# EAGLE design servo_tester (EAGLE 8.6.3)
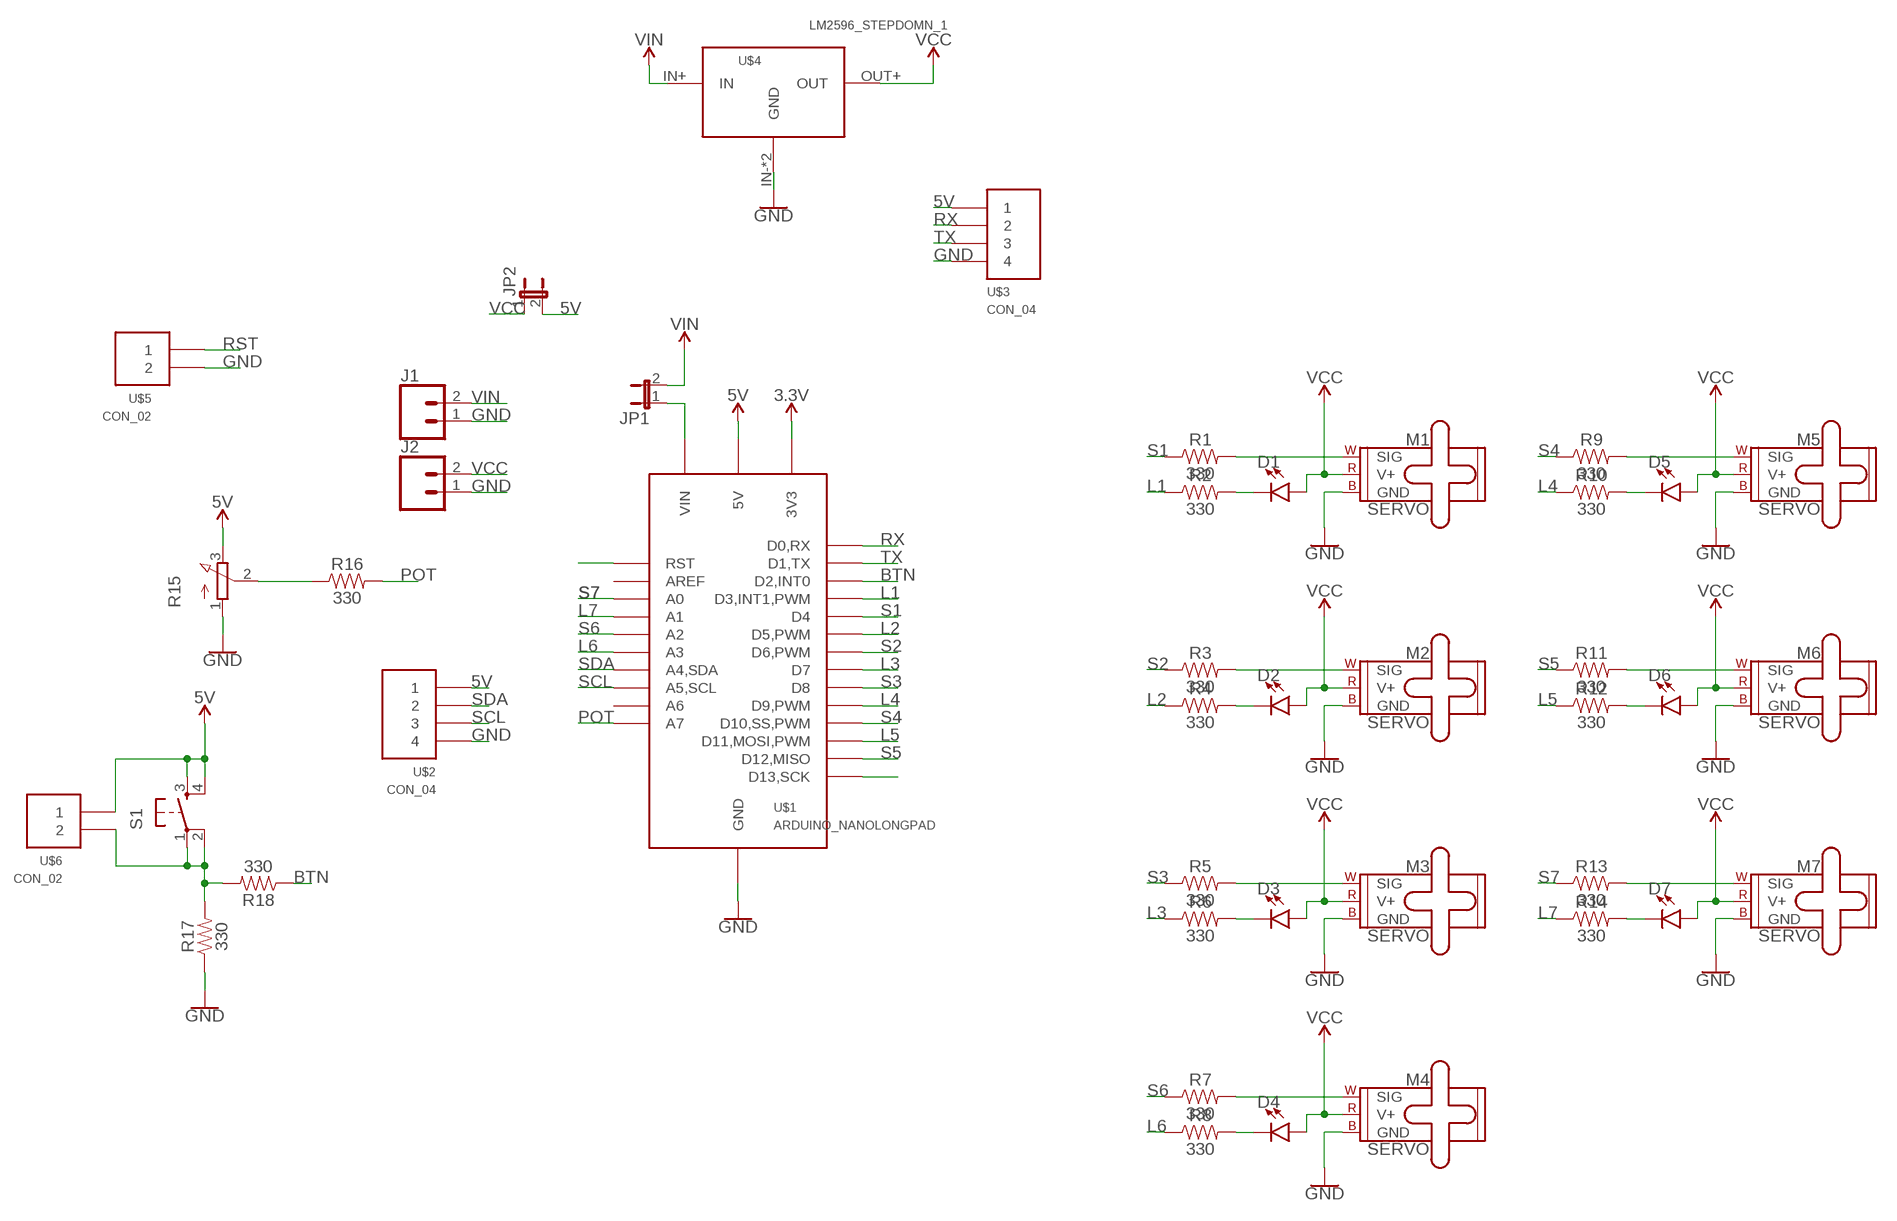
[diagram p0: schematic, sheet 1]

## Parts
D1  LED3MM  [LED_3MM]
D2  LED3MM  [LED_3MM]
D3  LED3MM  [LED_3MM]
D4  LED3MM  [LED_3MM]
D5  LED3MM  [LED_3MM]
D6  LED3MM  [LED_3MM]
D7  LED3MM  [LED_3MM]
J1  CONN_025MM  [SCREWTERMINAL-5MM-2]
J2  CONN_025MM  [SCREWTERMINAL-5MM-2]
JP1  JUMPER-2PTH  [1X02]
JP2  JUMPER-2PTH  [1X02]
M1  SERVO  [1X03]
M2  SERVO  [1X03]
M3  SERVO  [1X03]
M4  SERVO  [1X03]
M5  SERVO  [1X03]
M6  SERVO  [1X03]
M7  SERVO  [1X03]
R1  330  330OHM-0603-1/10W-1%  [0603]
R2  330  330OHM-0603-1/10W-1%  [0603]
R3  330  330OHM-0603-1/10W-1%  [0603]
R4  330  330OHM-0603-1/10W-1%  [0603]
R5  330  330OHM-0603-1/10W-1%  [0603]
R6  330  330OHM-0603-1/10W-1%  [0603]
R7  330  330OHM-0603-1/10W-1%  [0603]
R8  330  330OHM-0603-1/10W-1%  [0603]
R9  330  330OHM-0603-1/10W-1%  [0603]
R10  330  330OHM-0603-1/10W-1%  [0603]
R11  330  330OHM-0603-1/10W-1%  [0603]
R12  330  330OHM-0603-1/10W-1%  [0603]
R13  330  330OHM-0603-1/10W-1%  [0603]
R14  330  330OHM-0603-1/10W-1%  [0603]
R15  3RP/1610N  [3RP/1610N]
R16  330  330OHM-0603-1/10W-1%  [0603]
R17  330  330OHM-0603-1/10W-1%  [0603]
R18  330  330OHM-0603-1/10W-1%  [0603]
S1  TAC_SWITCHPTH  [TACTILE-PTH]
U$1  ARDUINO_NANOLONGPAD  [ARDUINO_MANO_LONGPAD]
U$2  CON_04  [4-PIN]
U$3  CON_04  [4-PIN]
U$4  LM2596_STEPDOMN_1  [STEPDOWN_1]
U$5  CON_02  [2-PIN]
U$6  CON_02  [2-PIN]

## Nets
3.3V: U$1.3V3
5V: JP2.2 R15.3(E) S1.3 S1.4 U$1.5V U$2.1 U$3.1 U$6.1
BTN: R18.1 U$1.D2(D2,INT0)
GND: J1.1 J2.1 M1.3(GND) M2.3(GND) M3.3(GND) M4.3(GND) M5.3(GND) M6.3(GND) M7.3(GND) R15.1(A) R17.1 U$1.GND@1(GND) U$1.GND@2(GND) U$2.4 U$3.4 U$4.IN-(GND) U$4.OUT-(GND) U$5.2
L1: R2.1 U$1.D3(D3,INT1,PWM)
L2: R4.1 U$1.D5(D5,PWM)
L3: R6.1 U$1.D7
L4: R10.1 U$1.D9(D9,PWM)
L5: R12.1 U$1.D11(D11,MOSI,PWM)
L6: R8.1 U$1.A3
L7: R14.1 U$1.A1
N$1: JP1.1 U$1.VIN
N$2: R15.2(S) R16.1
N$3: M1.1(SIG) R1.2
N$4: D1.K(C) R2.2
N$6: M2.1(SIG) R3.2
N$7: D2.K(C) R4.2
N$8: R17.2 R18.2 S1.1 S1.2 U$6.2
N$10: M3.1(SIG) R5.2
N$11: D3.K(C) R6.2
N$12: U$1.D13(D13,SCK)
N$15: M4.1(SIG) R7.2
N$16: D4.K(C) R8.2
N$19: M5.1(SIG) R9.2
N$20: D5.K(C) R10.2
N$23: M6.1(SIG) R11.2
N$24: D6.K(C) R12.2
N$27: M7.1(SIG) R13.2
N$28: D7.K(C) R14.2
POT: R16.2 U$1.A7
RST: U$1.RST@1(RST) U$1.RST@2(RST) U$5.1
RX: U$1.RX0(D0,RX) U$3.2
S1: R1.1 U$1.D4
S2: R3.1 U$1.D6(D6,PWM)
S3: R5.1 U$1.D8
S4: R9.1 U$1.D10(D10,SS,PWM)
S5: R11.1 U$1.D12(D12,MISO)
S6: R7.1 U$1.A2
S7: R13.1 U$1.A0
SCL: U$1.A5(A5,SCL) U$2.3
SDA: U$1.A4(A4,SDA) U$2.2
TX: U$1.TX1(D1,TX) U$3.3
VCC: D1.A D2.A D3.A D4.A D5.A D6.A D7.A J2.2 JP2.1 M1.2(V+) M2.2(V+) M3.2(V+) M4.2(V+) M5.2(V+) M6.2(V+) M7.2(V+) U$4.OUT+(OUT)
VIN: J1.2 JP1.2 U$4.IN+(IN)
Unconnected: U$1.A6 U$1.AREF

## Library data of the parts
D1-D7 = SparkFun-LED:LED: LED (Generic) Standard schematic elements and footprints for 5mm, 3mm, 1206, and 0603 sized LEDs. Generic LEDs with no color specified.; PROD_ID: DIO-08794
J1 J2 = SparkFun-Connectors:CONN_02: Multi connection point. Often used as Generic Header-pin footprint for 0.1 inch spaced/style header connections On any of the 0.1 inch spaced packages, you can populate with these: Break Away Headers - Straight <https://www.sparkfun.com/products/116> (PRT-00116) Break Away Male Headers - Right Angle <https://www.sparkfun.com/products/553> (PRT-00553) Female Headers <https://www.sparkfun.com/products/115> (PRT-00115) Break Away Headers - Machine Pin <https://www.sparkfun.com/products/117> (PRT-00117) Break Away Female Headers - Swiss Machine Pin <https://www.sparkfun.com/products/743> (PRT-00743) For SCREWTERMINALS and SPRING TERMINALS visit here: Screw Terimnals on SparkFun.com <https://www.sparkfun.com/search/results?term=Screw+Terminals> (5mm/3.5mm/2.54mm spacing) This device is also useful as a general connection point to wire up your design to another part of your project. Our various solder wires solder well into these plated through hole pads. Hook-Up Wire - Assortment (Stranded, 22 AWG) <https://www.sparkfun.com/products/11375> (PRT-11375) Hook-Up Wire - Assortment (Solid Core, 22 AWG) <https://www.sparkfun.com/products/11367> (PRT-11367) View the entire wire category on our website here <https://www.sparkfun.com/categories/141> Special notes: Molex polarized connector foot print use with: PRT-08233 with associated crimp pins and housings. 2.54_SCREWTERM for use with PRT-10571. 3.5mm Screw Terminal footprints for PRT-08084 5mm Screw Terminal footprints for use with PRT-08432; SF_SKU: PRT-08432
JP1 JP2 = SparkFun-Retired:JUMPER-2: Jumper Basic 0.1" spaced jumper. Use with breakaway headers.
M1-M7 = SparkFun-Electromechanical:SERVO: Servo Motor 3-pin connector for a standard servo motor (voltage supply, ground, and control signal.) SparkFun Products Servo - Generic (Sub-Micro Size) <https://www.sparkfun.com/products/9065> (ROB-09065) Servo - Generic High Torque Continuous Rotation (Standard Size) <https://www.sparkfun.com/products/9347> (ROB-09347) Servo - Generic High Torque (Standard Size) <https://www.sparkfun.com/products/11965> (ROB-11965)
R1-R14 R16-R18 = SparkFun-Resistors:330OHM: 330Ω resistor A resistor is a passive two-terminal electrical component that implements electrical resistance as a circuit element. Resistors act to reduce current flow, and, at the same time, act to lower voltage levels within circuits. - Wikipedia; PROD_ID: RES-00818
R15 = pot:3RP/1610N: 16mm Potentiometer one level Source: http://www.alphapotentiometers.net/html/16mm_pot_2.html
S1 = SparkFun-Retired:TAC_SWITCH: Momentary Switch Button commonly used for reset or general input. Spark Fun Electronics SKU : COM-00097 SMT- SWCH-08247
U$1 = Arduino_nano:ARDUINO_NANO
U$2 U$3 = con2001_by_Meng_V2:CON_04
U$4 = Switching_Regulator_Module:LM2596_STEPDOMN_1
U$5 U$6 = con2001_by_Meng_V2:CON_02

## Board
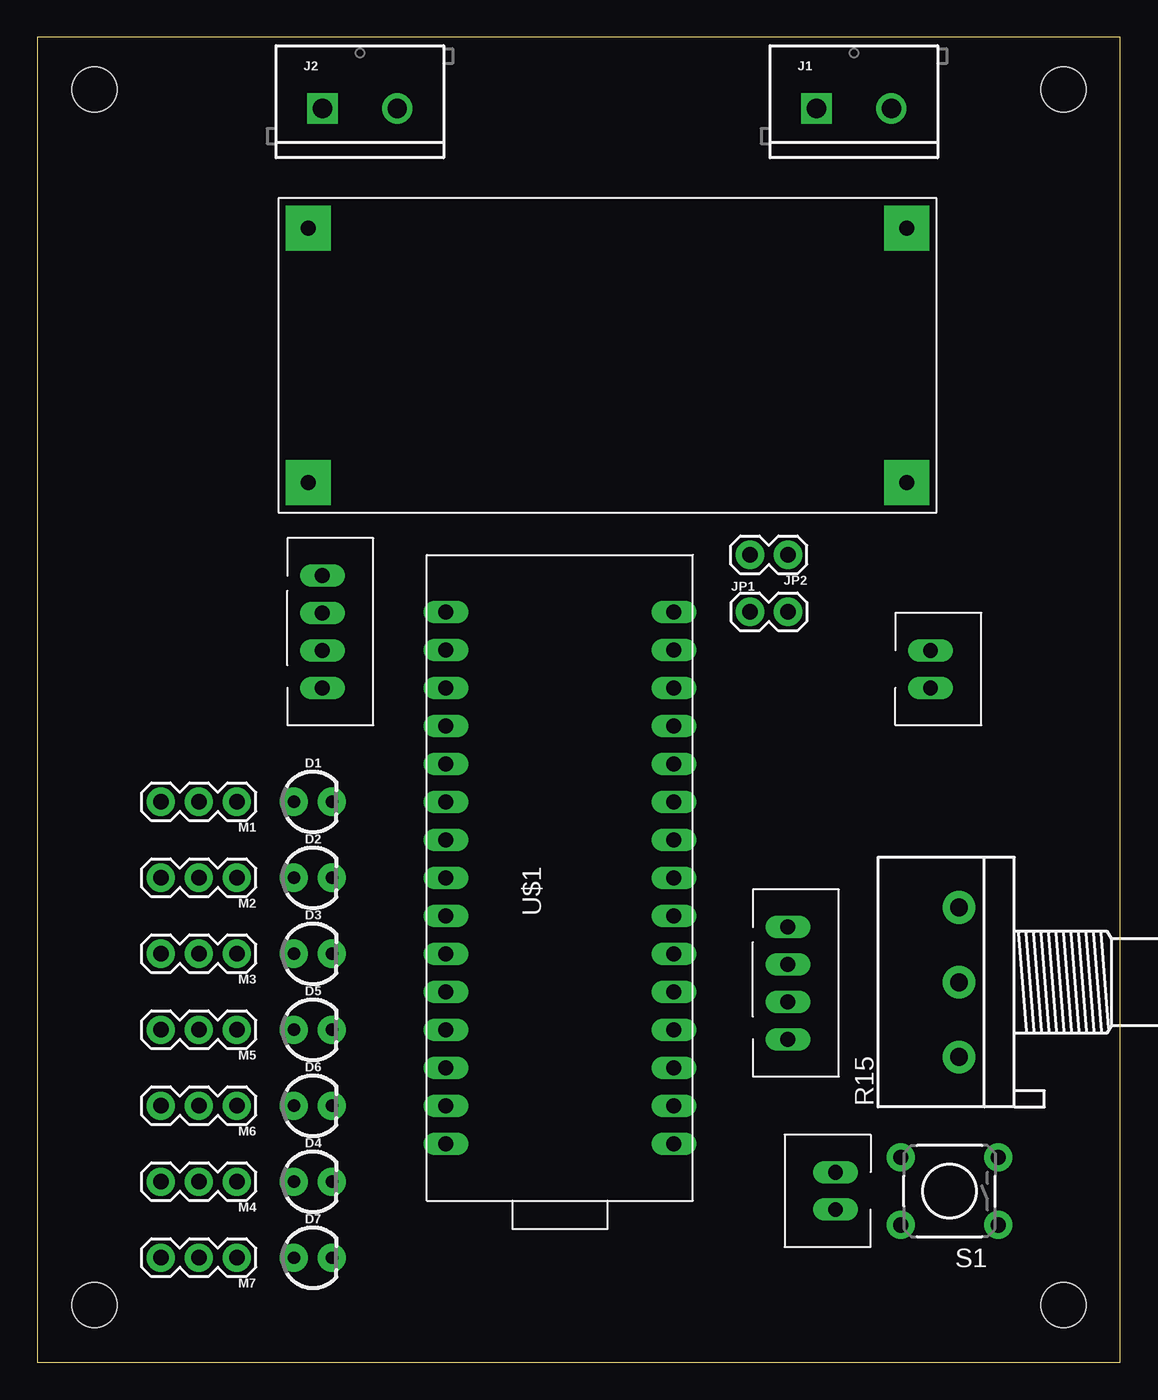
[diagram p1: board, top side]
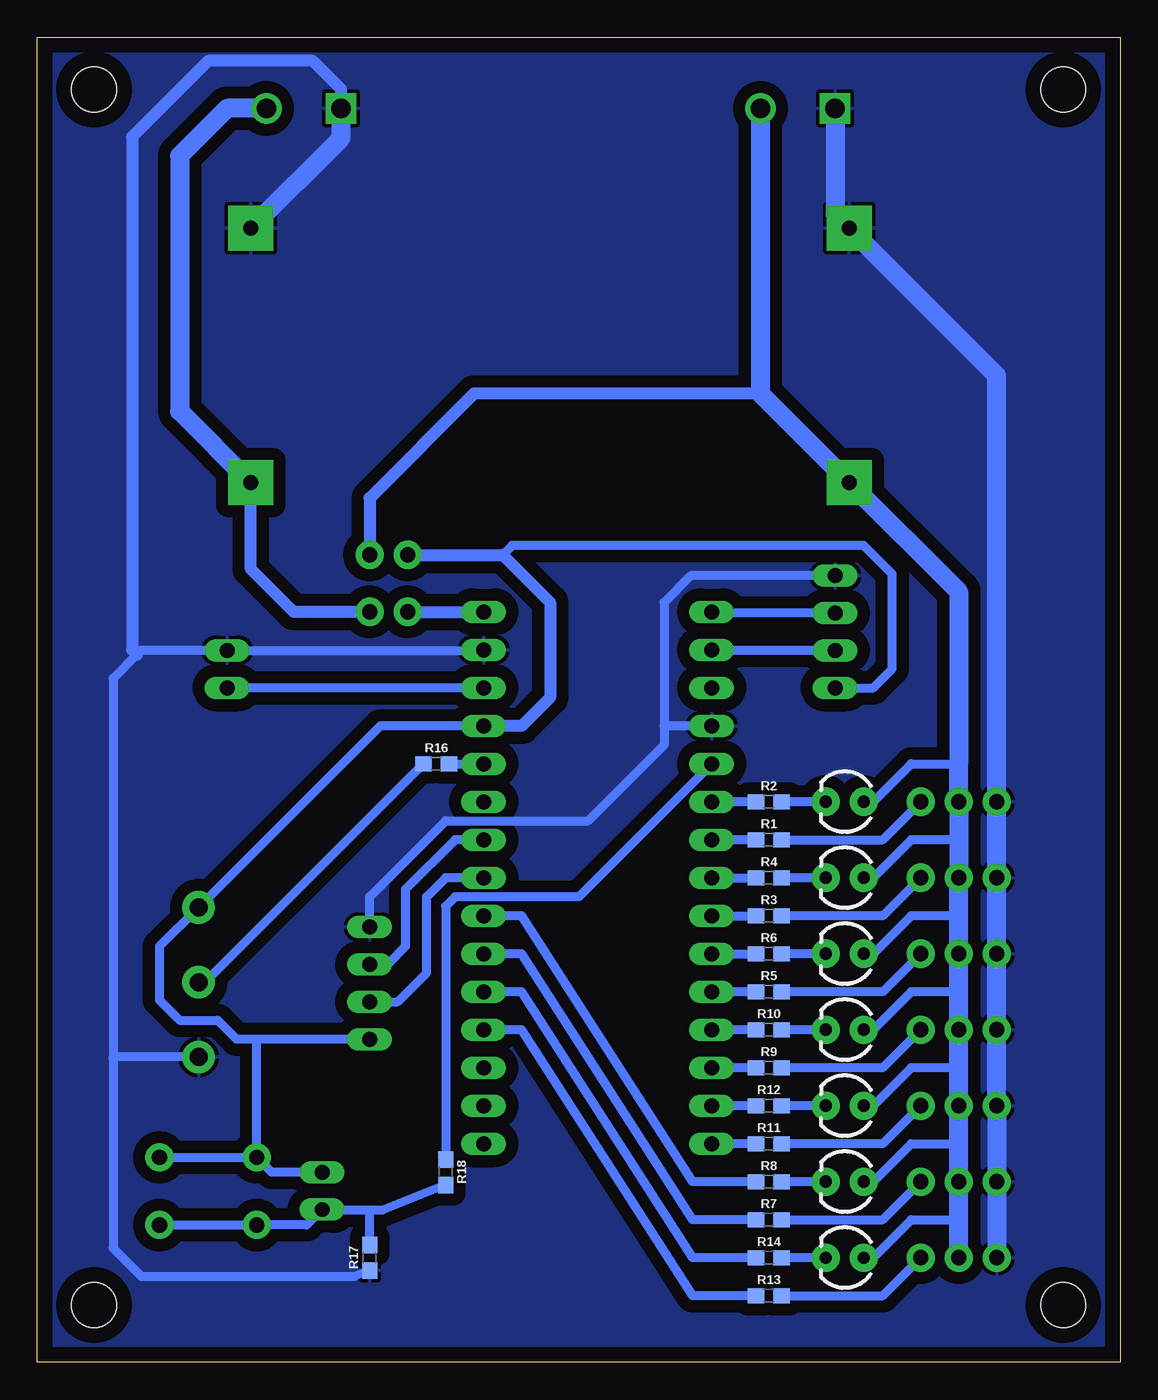
[diagram p2: board, bottom side, seen from below]

Size 72.37 x 88.57 mm. Coordinates in mm from the lower left corner, seen from the top.
Outline: 0,0 72.37,0 72.37,88.57 0,88.57 0,0
Copper layers (1*16): Top 0.035mm / dielectric 1.5mm / Bottom 0.035mm
Design rules "default": minimum track width 6mil, minimum drill 0.35mm, track to track 6mil, track to pad 6mil, pad to pad 6mil, via to via 6mil, smd to smd 6mil, copper to edge 40mil, drill to drill 6mil, minimum pad ring 10mil, minimum via ring 8mil, stop-mask expansion 4mil, vias tented up to drill 0mil, thermal gap 10mil
Holes 3 mm at 3.81,3.81 68.58,3.81 68.58,85.09 3.81,85.09

### Footprints (pad centres in the part's own frame; a part is rotated, then mirrored left to right if it is on the bottom)
LED_3MM = drill 0.813 pad 1.88: A -1.27,0; K 1.27,0
SCREWTERMINAL-5MM-2 = drill 1.3 pad 2.032 square: 1 0,0 | drill 1.3 pad 2.032: 2 5,0
1X02 = drill 1.016 pad 1.88: 1 0,0; 2 2.54,0
1X03 = drill 1.016 pad 1.88: 1 0,0; 2 2.54,0; 3 5.08,0
0603 = smd 1.1 x 1: 1 -0.85,0; 2 0.85,0
3RP/1610N = drill 1.2 pad 2.184: 1 -5,0; 2 0,0; 3 5,0
TACTILE-PTH = drill 1.016 pad 1.88: 1 -3.251,2.261; 2 3.251,2.261; 3 -3.251,-2.261; 4 3.251,-2.261
ARDUINO_MANO_LONGPAD = drill 1 long: 3V3 -15.24,-7.62; 5V 10.16,-7.62; A0 -10.16,-7.62; A1 -7.62,-7.62; A2 -5.08,-7.62; A3 -2.54,-7.62; A4 0,-7.62; A5 2.54,-7.62; A6 5.08,-7.62; A7 7.62,-7.62; AREF -12.7,-7.62; D2 7.62,7.62; D3 5.08,7.62; D4 2.54,7.62; D5 0,7.62; D6 -2.54,7.62; D7 -5.08,7.62; D8 -7.62,7.62; D9 -10.16,7.62; D10 -12.7,7.62; D11 -15.24,7.62; D12 -17.78,7.62; D13 -17.78,-7.62; GND@1 10.16,7.62; GND@2 15.24,-7.62; RST@1 12.7,7.62; RST@2 12.7,-7.62; RX0 15.24,7.62; TX1 17.78,7.62; VIN 17.78,-7.62
4-PIN = drill 1 long: 1 0,0; 2 2.5,0; 3 5,0; 4 7.5,0
STEPDOWN_1 = drill 1 pad 3 square: IN+ -20,8.5; IN- -20,-8.5; OUT+ 20,8.5; OUT- 20,-8.5
2-PIN = drill 1 long: 1 0,0; 2 2.5,0

### Placement (x,y rotation side)
D1  18.41,37.47 0 top
D2  18.41,32.38 0 top
D3  18.41,27.3 0 top
D4  18.41,12.06 0 top
D5  18.41,22.23 0 top
D6  18.41,17.14 0 top
D7  18.41,6.99 0 top
J1  52.07,83.82 0 top
J2  19.05,83.82 0 top
JP1  47.62,50.16 0 top
JP2  50.16,53.98 180 top
M1  13.34,37.47 180 top
M2  13.34,32.38 180 top
M3  13.34,27.3 180 top
M4  13.34,12.06 180 top
M5  13.34,22.23 180 top
M6  13.34,17.14 180 top
M7  13.34,6.99 180 top
R1  23.5,34.92 0 bottom
R2  23.5,37.47 0 bottom
R3  23.5,29.84 0 bottom
R4  23.5,32.38 0 bottom
R5  23.5,24.77 0 bottom
R6  23.5,27.3 0 bottom
R7  23.5,9.53 0 bottom
R8  23.5,12.06 0 bottom
R9  23.5,19.68 0 bottom
R10  23.5,22.23 0 bottom
R11  23.5,14.61 0 bottom
R12  23.5,17.14 0 bottom
R13  23.5,4.45 0 bottom
R14  23.5,6.99 0 bottom
R15  61.59,25.4 90 top
R16  45.72,40.01 0 bottom
R17  50.16,6.99 90 bottom
R18  45.09,12.7 270 bottom
S1  60.96,11.43 180 top
U$1  34.92,32.38 90 top
U$2  50.16,21.59 90 top
U$3  19.05,45.09 90 top
U$4  38.1,67.31 180 top
U$5  59.69,45.09 90 top
U$6  53.34,12.7 270 top

### Tracks (layer width: path | path; a pad name or v marks a point on that pad's centre or on a via)
5V
  Bottom 0.61: S1.3 S1.4 | U$1.5V 43.18,42.55 49.45,42.55 R15.3 64.21,27.78 64.21,24.21 62.87,22.86 60.33,22.86 59.05,21.59 57.78,21.59 | U$6.1 56.72,12.7 S1.4 | U$2.1 57.78,21.59 | S1.4 57.71,21.51 57.78,21.59 | U$3.1 16.51,45.09 15.24,46.35 15.24,52.7 17.14,54.61 40.64,54.61 41.27,53.98
  Bottom 0.813: JP2.2 41.27,53.98 38.1,50.8 38.1,44.45 40.01,42.55 43.18,42.55
BTN
  Bottom 0.61: U$1.D2 36.2,31.11 44.45,31.11 45.09,30.48 R18.1
GND
  Bottom 0.61: U$1.GND@2 42.59,47.59 U$5.2 65.44,47.59 65.72,47.31 67.31,45.72 67.31,20.32 | R17.1 51.22,5.71 65.41,5.71 67.31,7.62 67.31,20.32 | R15.1 67.23,20.4 67.31,20.32 | U$3.4 28.7,52.59 30.48,50.8 30.48,42.55 | 30.48,42.55 30.48,41.27 35.56,36.2 45.09,36.2 50.16,31.11 U$2.4 | 28.57,42.55 U$1.GND@1 30.48,42.55
  Bottom 0.813: J1.1 52.07,85.09 53.98,87 60.96,87 66.04,81.92 66.04,47.62 65.72,47.31
  Bottom 1.27: M7.3 M4.3 M6.3 M5.3 M3.3 M2.3 M1.3 8.26,65.97 U$4.OUT- 19.05,76.76 J2.1 | U$4.IN- 52.07,81.84 J1.1
  pour Bottom (isolate 0.813): 0,0 72.39,0 72.39,91.44 0,91.44
L1
  Bottom 0.61: R2.1 U$1.D3
L2
  Bottom 0.61: U$1.D5 R4.1
L3
  Bottom 0.61: U$1.D7 R6.1
L4
  Bottom 0.61: R10.1 U$1.D9
L5
  Bottom 0.61: R12.1 U$1.D11
L6
  Bottom 0.61: U$1.A3 40.01,29.84 28.57,12.06 R8.1
L7
  Bottom 0.61: U$1.A1 40.01,24.77 28.57,6.99 R14.1
N$1
  Bottom 0.813: JP1.1 U$1.VIN
N$2
  Bottom 0.61: R16.1 61.17,25.4 R15.2
N$3
  Bottom 0.61: R1.2 15.88,34.92 M1.1
N$4
  Bottom 0.61: D1.K R2.2
N$5
  pour Bottom: 26.67,77.47 26.67,68.58 54.61,68.58 54.61,77.47
N$6
  Bottom 0.61: M2.1 15.88,29.84 R3.2
N$7
  Bottom 0.61: D2.K R4.2
N$8
  Bottom 0.61: S1.1 S1.2 54.37,9.17 U$6.2 53.3,10.16 50.16,10.16 | R17.2 50.16,10.16 | R18.2 49.31,10.16 50.16,10.16
N$10
  Bottom 0.61: M3.1 15.88,24.77 R5.2
N$11
  Bottom 0.61: D3.K R6.2
N$15
  Bottom 0.61: R7.2 15.88,9.53 M4.1
N$16
  Bottom 0.61: D4.K R8.2
N$19
  Bottom 0.61: M5.1 15.88,19.68 R9.2
N$20
  Bottom 0.61: D5.K R10.2
N$23
  Bottom 0.61: M6.1 15.88,14.61 R11.2
N$24
  Bottom 0.61: D6.K R12.2
N$27
  Bottom 0.61: R13.2 15.88,4.45 M7.1
N$28
  Bottom 0.61: D7.K R14.2
POT
  Bottom 0.61: R16.2 U$1.A7
RST
  Bottom 0.61: U$1.RST@2 U$5.1
RX
  Bottom 0.61: U$3.2 27.27,47.59 U$1.RX0
S1
  Bottom 0.61: R1.1 U$1.D4
S2
  Bottom 0.61: U$1.D6 R3.1
S3
  Bottom 0.61: R5.1 U$1.D8
S4
  Bottom 0.61: R9.1 U$1.D10
S5
  Bottom 0.61: R11.1 U$1.D12
S6
  Bottom 0.61: U$1.A2 40.01,27.3 28.57,9.53 R7.1
S7
  Bottom 0.61: U$1.A0 40.01,22.23 28.57,4.45 R13.1
SCL
  Bottom 0.61: 43.7,34.85 42.62,34.85 U$1.A5 44.45,34.92 47.75,31.62 47.75,27.81 48.9,26.67 50.09,26.67 U$2.3
SDA
  Bottom 0.61: U$1.A4 45.09,32.38 46.35,31.11 46.35,26.04 48.3,24.09 U$2.2
TX
  Bottom 0.61: U$3.3 27.23,50.09 U$1.TX1
VCC
  Bottom 0.61: D6.A 16.51,17.14 13.97,19.68 10.79,19.68 | 10.79,24.77 13.97,24.77 16.51,22.23 D5.A | 10.79,29.84 13.97,29.84 16.51,27.3 D3.A | 10.79,34.92 13.97,34.92 16.51,32.38 D2.A | D1.A 16.51,37.47 13.97,40.01 10.79,40.01 | D4.A 16.51,12.06 13.97,14.61 10.79,14.61 | D7.A 16.51,6.99 13.97,9.53 10.79,9.53
  Bottom 0.813: 24.05,64.76 43.19,64.76 50.16,57.78 JP2.1
  Bottom 1.27: M7.2 10.79,9.53 M4.2 10.79,14.61 M6.2 10.79,19.68 M5.2 10.79,24.77 M3.2 10.79,29.84 M2.2 10.79,34.92 M1.2 10.79,40.01 10.79,51.51 U$4.OUT+ 24.05,64.76 J2.2
VIN
  Bottom 0.813: JP1.2 55.24,50.16 58.1,53.02 U$4.IN+
  Bottom 1.27: J1.2 59.69,83.82 62.87,80.64 62.87,63.58 U$4.IN+

### Text on the board
bRestrict: Meng's Lab